# EAGLE schematic buck (EAGLE 9.3.0)

## Sheet 1 of 3: PLUGS
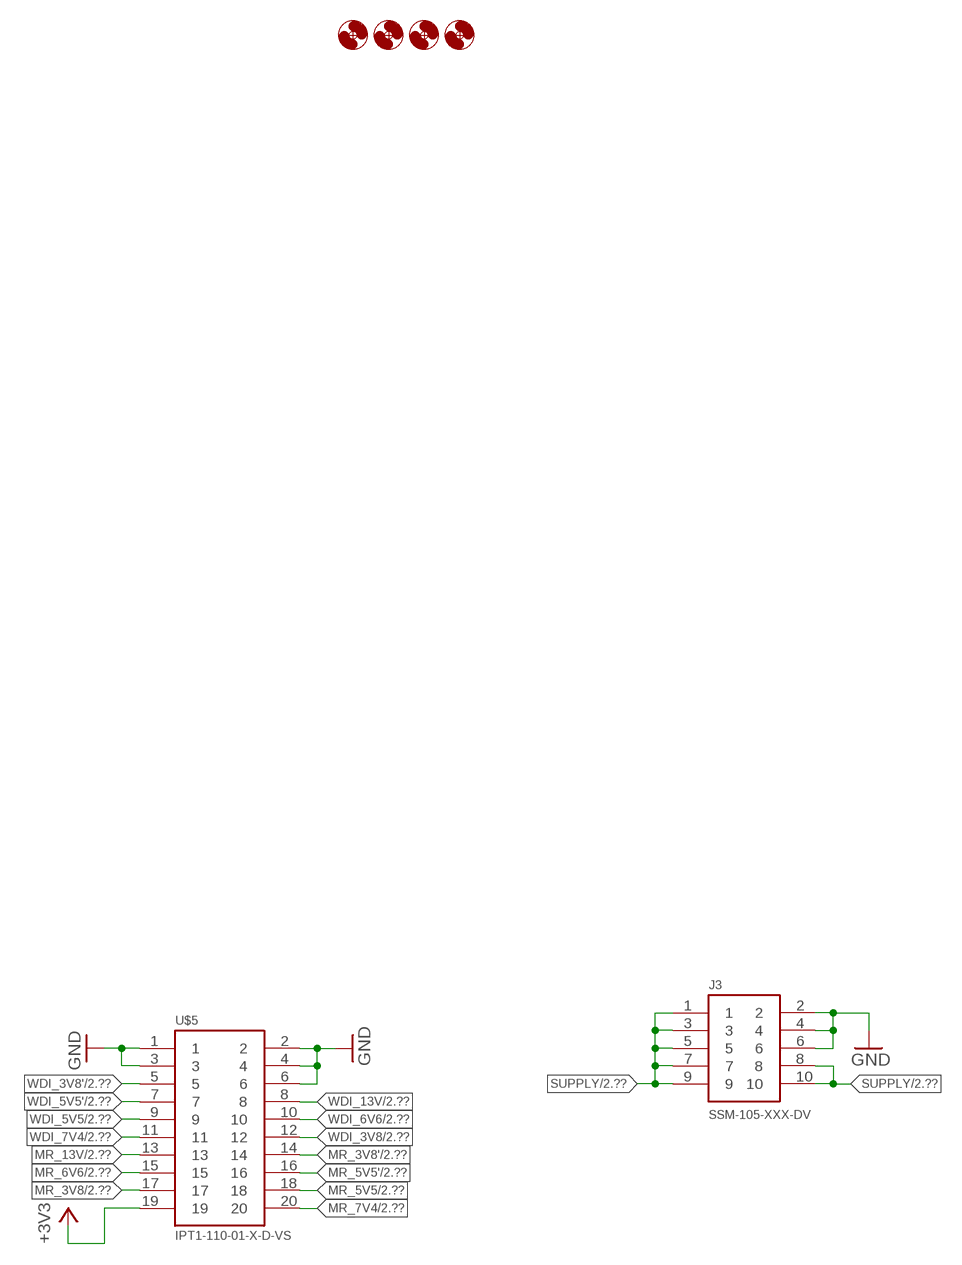
[diagram p0: schematic, sheet 1]

### Parts
H1  MOUNT-HOLE3.2  [3,2]
H2  MOUNT-HOLE3.2  [3,2]
H3  MOUNT-HOLE3.2  [3,2]
H4  MOUNT-HOLE3.2  [3,2]
J3  SSM-105-XXX-DV  [SSM-105-XXX-DV]
U$5  IPT1-110-01-X-D-VS  [IPT1-110-01-X-D-VS]

### Nets
+3V3: U$5.19 ; also sheet 2
GND: J3.2 J3.4 J3.6 U$5.1 U$5.2 U$5.3 U$5.4 U$5.6 ; also sheet 2,3
MR_3V8: U$5.17 ; also sheet 2
MR_3V8': U$5.14 ; also sheet 2
MR_5V5: U$5.18 ; also sheet 2
MR_5V5': U$5.16 ; also sheet 2
MR_6V6: U$5.15 ; also sheet 2
MR_7V4: U$5.20 ; also sheet 2
MR_13V: U$5.13 ; also sheet 2
SUPPLY [test]: J3.1 J3.3 J3.5 J3.7 J3.8 J3.9 J3.10 ; also sheet 2
WDI_3V8: U$5.12 ; also sheet 2
WDI_3V8': U$5.5 ; also sheet 2
WDI_5V5: U$5.9 ; also sheet 2
WDI_5V5': U$5.7 ; also sheet 2
WDI_6V6: U$5.10 ; also sheet 2
WDI_7V4: U$5.11 ; also sheet 2
WDI_13V: U$5.8 ; also sheet 2

## Sheet 2 of 3
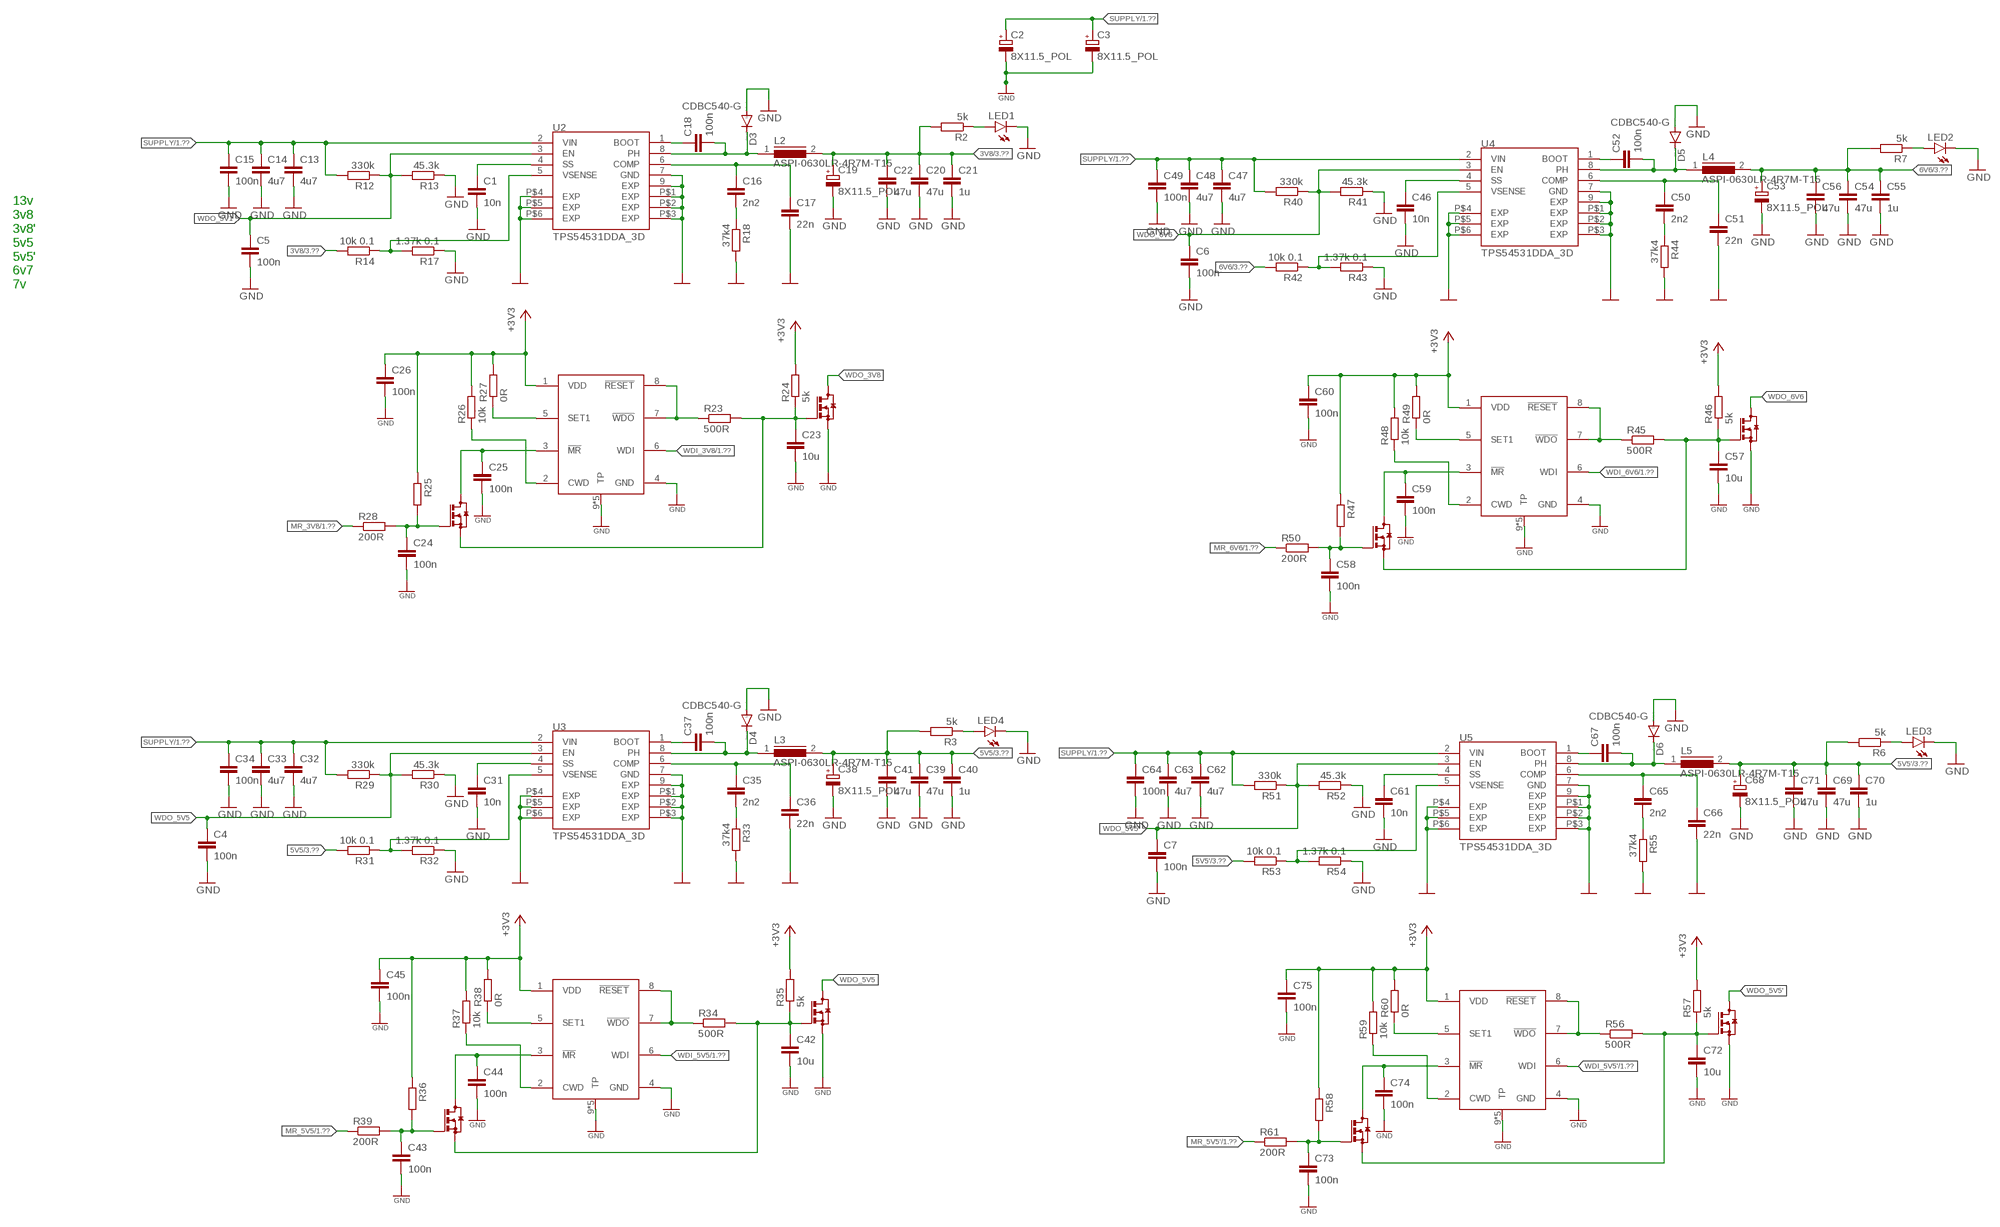
[diagram p1: schematic, sheet 2, part 1 of 2]
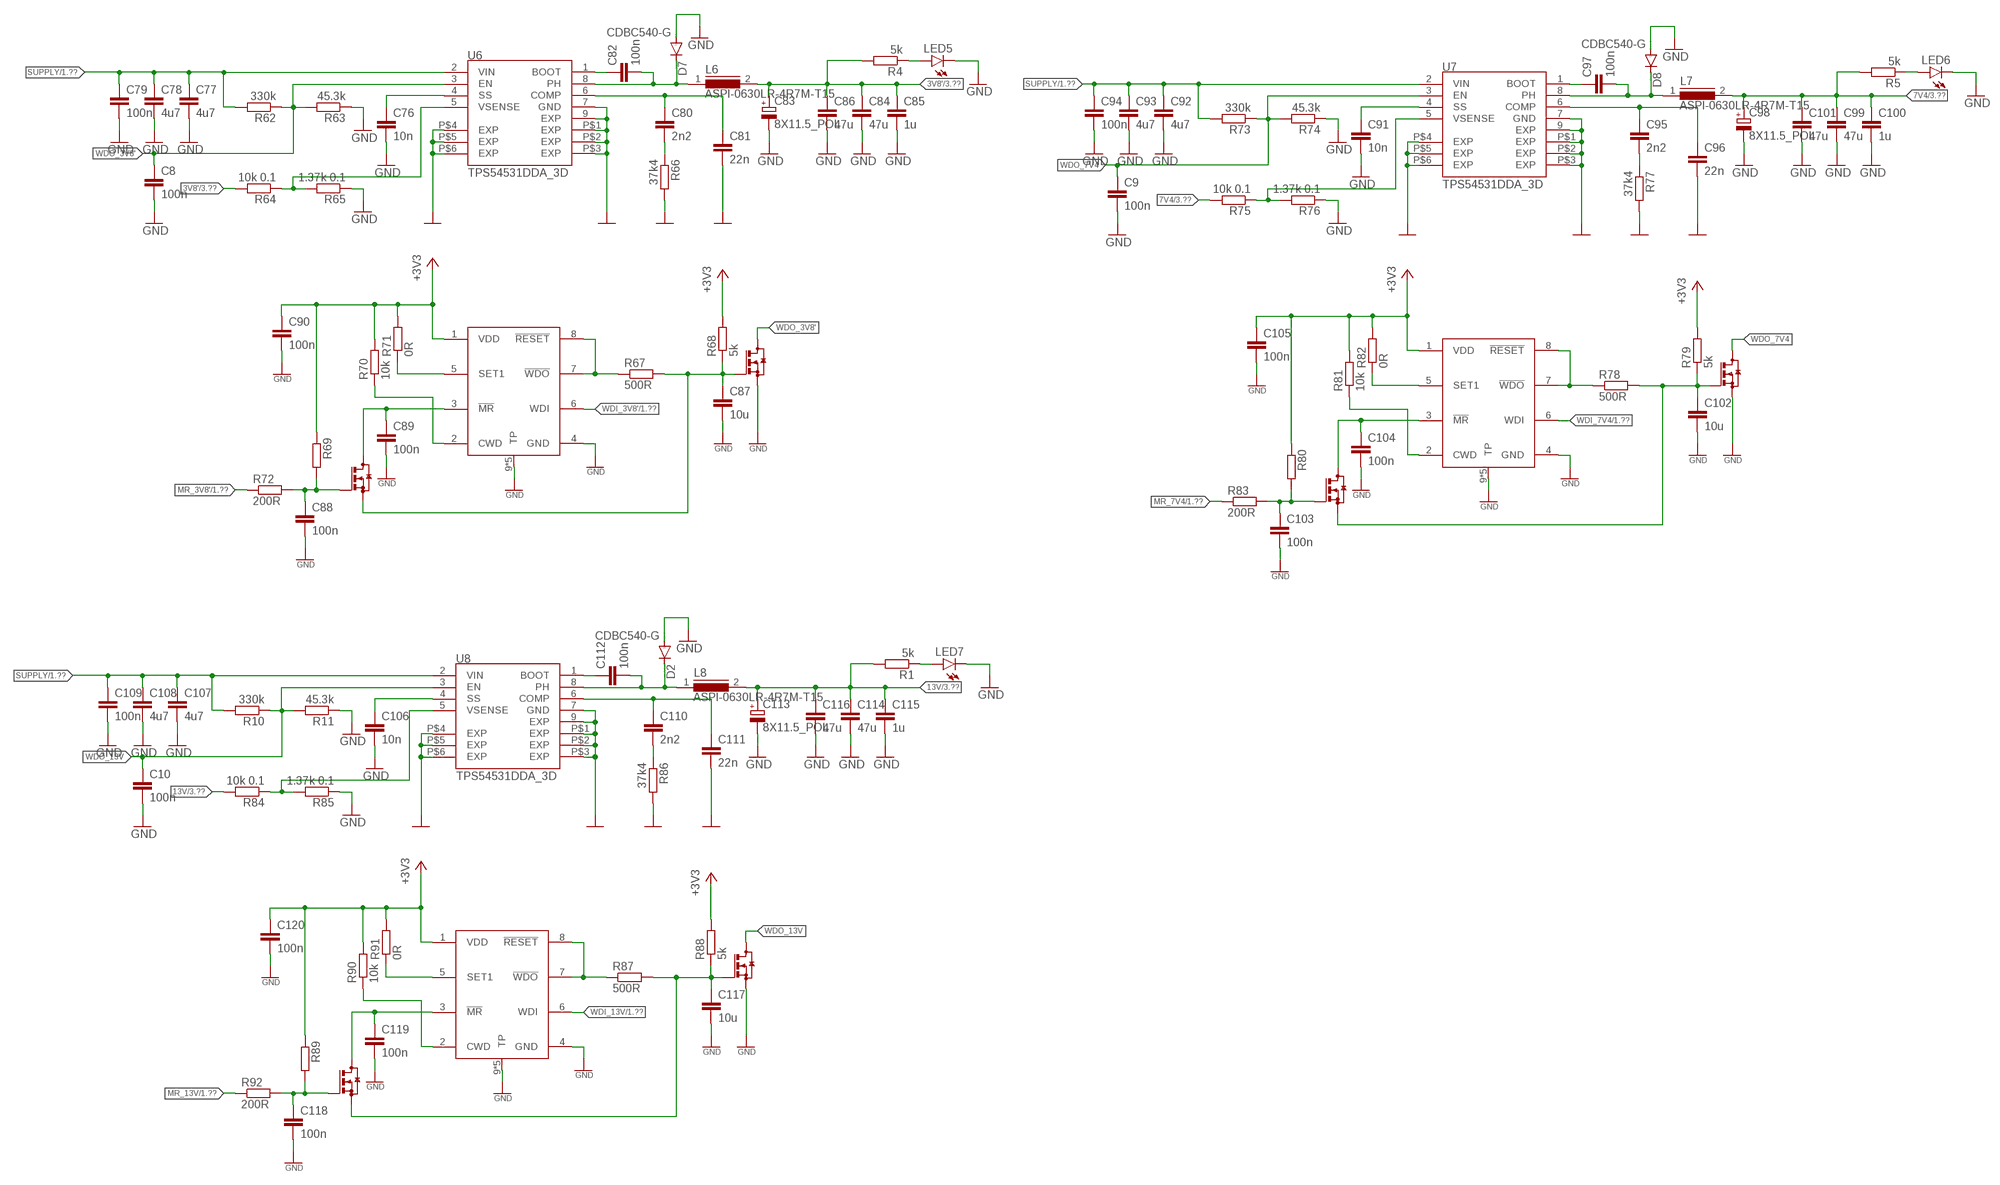
[diagram p2: schematic, sheet 2, part 2 of 2]

### Parts
C1  10n  C-EUC0603K  [C0603K]
C2  8X11.5_POL  [CAPPRD350W65D800H1150A]
C3  8X11.5_POL  [CAPPRD350W65D800H1150A]
C4  100n  C-EUC0603K  [C0603K]
C5  100n  C-EUC0603K  [C0603K]
C6  100n  C-EUC0603K  [C0603K]
C7  100n  C-EUC0603K  [C0603K]
C8  100n  C-EUC0603K  [C0603K]
C9  100n  C-EUC0603K  [C0603K]
C10  100n  C-EUC0603K  [C0603K]
C13  4u7  C-EUC0805K  [C0805K]
C14  4u7  C-EUC0805K  [C0805K]
C15  100n  C-EUC0603K  [C0603K]
C16  2n2  C-EUC0603K  [C0603K]
C17  22n  C-EUC0603K  [C0603K]
C18  100n  C-EUC0603K  [C0603K]
C19  8X11.5_POL  [CAPPRD350W65D800H1150A]
C20  47u  C-EUC1210  [C1210]
C21  1u  C-EUC0603K  [C0603K]
C22  47u  C-EUC1210  [C1210]
C23  10u  C-EUC0805K  [C0805K]
C24  100n  C-EUC0603K  [C0603K]
C25  100n  C-EUC0603K  [C0603K]
C26  100n  C-EUC0603K  [C0603K]
C31  10n  C-EUC0603K  [C0603K]
C32  4u7  C-EUC0805K  [C0805K]
C33  4u7  C-EUC0805K  [C0805K]
C34  100n  C-EUC0603K  [C0603K]
C35  2n2  C-EUC0603K  [C0603K]
C36  22n  C-EUC0603K  [C0603K]
C37  100n  C-EUC0603K  [C0603K]
C38  8X11.5_POL  [CAPPRD350W65D800H1150A]
C39  47u  C-EUC1210  [C1210]
C40  1u  C-EUC0603K  [C0603K]
C41  47u  C-EUC1210  [C1210]
C42  10u  C-EUC0805K  [C0805K]
C43  100n  C-EUC0603K  [C0603K]
C44  100n  C-EUC0603K  [C0603K]
C45  100n  C-EUC0603K  [C0603K]
C46  10n  C-EUC0603K  [C0603K]
C47  4u7  C-EUC0805K  [C0805K]
C48  4u7  C-EUC0805K  [C0805K]
C49  100n  C-EUC0603K  [C0603K]
C50  2n2  C-EUC0603K  [C0603K]
C51  22n  C-EUC0603K  [C0603K]
C52  100n  C-EUC0603K  [C0603K]
C53  8X11.5_POL  [CAPPRD350W65D800H1150A]
C54  47u  C-EUC1210  [C1210]
C55  1u  C-EUC0603K  [C0603K]
C56  47u  C-EUC1210  [C1210]
C57  10u  C-EUC0805K  [C0805K]
C58  100n  C-EUC0603K  [C0603K]
C59  100n  C-EUC0603K  [C0603K]
C60  100n  C-EUC0603K  [C0603K]
C61  10n  C-EUC0603K  [C0603K]
C62  4u7  C-EUC0805K  [C0805K]
C63  4u7  C-EUC0805K  [C0805K]
C64  100n  C-EUC0603K  [C0603K]
C65  2n2  C-EUC0603K  [C0603K]
C66  22n  C-EUC0603K  [C0603K]
C67  100n  C-EUC0603K  [C0603K]
C68  8X11.5_POL  [CAPPRD350W65D800H1150A]
C69  47u  C-EUC1210  [C1210]
C70  1u  C-EUC0603K  [C0603K]
C71  47u  C-EUC1210  [C1210]
C72  10u  C-EUC0805K  [C0805K]
C73  100n  C-EUC0603K  [C0603K]
C74  100n  C-EUC0603K  [C0603K]
C75  100n  C-EUC0603K  [C0603K]
C76  10n  C-EUC0603K  [C0603K]
C77  4u7  C-EUC0805K  [C0805K]
C78  4u7  C-EUC0805K  [C0805K]
C79  100n  C-EUC0603K  [C0603K]
C80  2n2  C-EUC0603K  [C0603K]
C81  22n  C-EUC0603K  [C0603K]
C82  100n  C-EUC0603K  [C0603K]
C83  8X11.5_POL  [CAPPRD350W65D800H1150A]
C84  47u  C-EUC1210  [C1210]
C85  1u  C-EUC0603K  [C0603K]
C86  47u  C-EUC1210  [C1210]
C87  10u  C-EUC0805K  [C0805K]
C88  100n  C-EUC0603K  [C0603K]
C89  100n  C-EUC0603K  [C0603K]
C90  100n  C-EUC0603K  [C0603K]
C91  10n  C-EUC0603K  [C0603K]
C92  4u7  C-EUC0805K  [C0805K]
C93  4u7  C-EUC0805K  [C0805K]
C94  100n  C-EUC0603K  [C0603K]
C95  2n2  C-EUC0603K  [C0603K]
C96  22n  C-EUC0603K  [C0603K]
C97  100n  C-EUC0603K  [C0603K]
C98  8X11.5_POL  [CAPPRD350W65D800H1150A]
C99  47u  C-EUC1210  [C1210]
C100  1u  C-EUC0603K  [C0603K]
C101  47u  C-EUC1210  [C1210]
C102  10u  C-EUC0805K  [C0805K]
C103  100n  C-EUC0603K  [C0603K]
C104  100n  C-EUC0603K  [C0603K]
C105  100n  C-EUC0603K  [C0603K]
C106  10n  C-EUC0603K  [C0603K]
C107  4u7  C-EUC0805K  [C0805K]
C108  4u7  C-EUC0805K  [C0805K]
C109  100n  C-EUC0603K  [C0603K]
C110  2n2  C-EUC0603K  [C0603K]
C111  22n  C-EUC0603K  [C0603K]
C112  100n  C-EUC0603K  [C0603K]
C113  8X11.5_POL  [CAPPRD350W65D800H1150A]
C114  47u  C-EUC1210  [C1210]
C115  1u  C-EUC0603K  [C0603K]
C116  47u  C-EUC1210  [C1210]
C117  10u  C-EUC0805K  [C0805K]
C118  100n  C-EUC0603K  [C0603K]
C119  100n  C-EUC0603K  [C0603K]
C120  100n  C-EUC0603K  [C0603K]
D2  CDBC540-G  DIODE-SMC  [SMC]
D3  CDBC540-G  DIODE-SMC  [SMC]
D4  CDBC540-G  DIODE-SMC  [SMC]
D5  CDBC540-G  DIODE-SMC  [SMC]
D6  CDBC540-G  DIODE-SMC  [SMC]
D7  CDBC540-G  DIODE-SMC  [SMC]
D8  CDBC540-G  DIODE-SMC  [SMC]
L2  ASPI-0630LR-4R7M-T15  DR74  [DR74]
L3  ASPI-0630LR-4R7M-T15  DR74  [DR74]
L4  ASPI-0630LR-4R7M-T15  DR74  [DR74]
L5  ASPI-0630LR-4R7M-T15  DR74  [DR74]
L6  ASPI-0630LR-4R7M-T15  DR74  [DR74]
L7  ASPI-0630LR-4R7M-T15  DR74  [DR74]
L8  ASPI-0630LR-4R7M-T15  DR74  [DR74]
LED1  LEDCHIPLED_0603  [CHIPLED_0603]
LED2  LEDCHIPLED_0603  [CHIPLED_0603]
LED3  LEDCHIPLED_0603  [CHIPLED_0603]
LED4  LEDCHIPLED_0603  [CHIPLED_0603]
LED5  LEDCHIPLED_0603  [CHIPLED_0603]
LED6  LEDCHIPLED_0603  [CHIPLED_0603]
LED7  LEDCHIPLED_0603  [CHIPLED_0603]
Q1  BSS123  [SOT23]
Q2  BSS123  [SOT23]
Q5  BSS123  [SOT23]
Q6  BSS123  [SOT23]
Q7  BSS123  [SOT23]
Q8  BSS123  [SOT23]
Q9  BSS123  [SOT23]
Q10  BSS123  [SOT23]
Q11  BSS123  [SOT23]
Q12  BSS123  [SOT23]
Q13  BSS123  [SOT23]
Q14  BSS123  [SOT23]
Q15  BSS123  [SOT23]
Q16  BSS123  [SOT23]
R1  5k  R-EU_R0603  [R0603]
R2  5k  R-EU_R0603  [R0603]
R3  5k  R-EU_R0603  [R0603]
R4  5k  R-EU_R0603  [R0603]
R5  5k  R-EU_R0603  [R0603]
R6  5k  R-EU_R0603  [R0603]
R7  5k  R-EU_R0603  [R0603]
R10  330k  R-EU_R0603  [R0603]
R11  45.3k  R-EU_R0603  [R0603]
R12  330k  R-EU_R0603  [R0603]
R13  45.3k  R-EU_R0603  [R0603]
R14  10k 0.1  R-EU_R0603  [R0603]
R17  1.37k 0.1  R-EU_R0603  [R0603]
R18  37k4  R-EU_R0603  [R0603]
R23  500R  R-EU_R0603  [R0603]
R24  5k  R-EU_R0603  [R0603]
R25  R-EU_R0603  [R0603]
R26  10k  R-EU_R0603  [R0603]
R27  0R  R-EU_R0603  [R0603]
R28  200R  R-EU_R0603  [R0603]
R29  330k  R-EU_R0603  [R0603]
R30  45.3k  R-EU_R0603  [R0603]
R31  10k 0.1  R-EU_R0603  [R0603]
R32  1.37k 0.1  R-EU_R0603  [R0603]
R33  37k4  R-EU_R0603  [R0603]
R34  500R  R-EU_R0603  [R0603]
R35  5k  R-EU_R0603  [R0603]
R36  R-EU_R0603  [R0603]
R37  10k  R-EU_R0603  [R0603]
R38  0R  R-EU_R0603  [R0603]
R39  200R  R-EU_R0603  [R0603]
R40  330k  R-EU_R0603  [R0603]
R41  45.3k  R-EU_R0603  [R0603]
R42  10k 0.1  R-EU_R0603  [R0603]
R43  1.37k 0.1  R-EU_R0603  [R0603]
R44  37k4  R-EU_R0603  [R0603]
R45  500R  R-EU_R0603  [R0603]
R46  5k  R-EU_R0603  [R0603]
R47  R-EU_R0603  [R0603]
R48  10k  R-EU_R0603  [R0603]
R49  0R  R-EU_R0603  [R0603]
R50  200R  R-EU_R0603  [R0603]
R51  330k  R-EU_R0603  [R0603]
R52  45.3k  R-EU_R0603  [R0603]
R53  10k 0.1  R-EU_R0603  [R0603]
R54  1.37k 0.1  R-EU_R0603  [R0603]
R55  37k4  R-EU_R0603  [R0603]
R56  500R  R-EU_R0603  [R0603]
R57  5k  R-EU_R0603  [R0603]
R58  R-EU_R0603  [R0603]
R59  10k  R-EU_R0603  [R0603]
R60  0R  R-EU_R0603  [R0603]
R61  200R  R-EU_R0603  [R0603]
R62  330k  R-EU_R0603  [R0603]
R63  45.3k  R-EU_R0603  [R0603]
R64  10k 0.1  R-EU_R0603  [R0603]
R65  1.37k 0.1  R-EU_R0603  [R0603]
R66  37k4  R-EU_R0603  [R0603]
R67  500R  R-EU_R0603  [R0603]
R68  5k  R-EU_R0603  [R0603]
R69  R-EU_R0603  [R0603]
R70  10k  R-EU_R0603  [R0603]
R71  0R  R-EU_R0603  [R0603]
R72  200R  R-EU_R0603  [R0603]
R73  330k  R-EU_R0603  [R0603]
R74  45.3k  R-EU_R0603  [R0603]
R75  10k 0.1  R-EU_R0603  [R0603]
R76  1.37k 0.1  R-EU_R0603  [R0603]
R77  37k4  R-EU_R0603  [R0603]
R78  500R  R-EU_R0603  [R0603]
R79  5k  R-EU_R0603  [R0603]
R80  R-EU_R0603  [R0603]
R81  10k  R-EU_R0603  [R0603]
R82  0R  R-EU_R0603  [R0603]
R83  200R  R-EU_R0603  [R0603]
R84  10k 0.1  R-EU_R0603  [R0603]
R85  1.37k 0.1  R-EU_R0603  [R0603]
R86  37k4  R-EU_R0603  [R0603]
R87  500R  R-EU_R0603  [R0603]
R88  5k  R-EU_R0603  [R0603]
R89  R-EU_R0603  [R0603]
R90  10k  R-EU_R0603  [R0603]
R91  0R  R-EU_R0603  [R0603]
R92  200R  R-EU_R0603  [R0603]
U2  TPS54531DDA_3D  [SOIC127P600X150-9T240X310]
U3  TPS54531DDA_3D  [SOIC127P600X150-9T240X310]
U4  TPS54531DDA_3D  [SOIC127P600X150-9T240X310]
U5  TPS54531DDA_3D  [SOIC127P600X150-9T240X310]
U6  TPS54531DDA_3D  [SOIC127P600X150-9T240X310]
U7  TPS54531DDA_3D  [SOIC127P600X150-9T240X310]
U8  TPS54531DDA_3D  [SOIC127P600X150-9T240X310]
U$6  TPS3852  [SON65P300X300X100-9N]
U$7  TPS3852  [SON65P300X300X100-9N]
U$8  TPS3852  [SON65P300X300X100-9N]
U$9  TPS3852  [SON65P300X300X100-9N]
U$10  TPS3852  [SON65P300X300X100-9N]
U$11  TPS3852  [SON65P300X300X100-9N]
U$12  TPS3852  [SON65P300X300X100-9N]

### Nets
3V8 [test]: C19.1(+) C20.1 C21.1 C22.1 L2.2 R2.2 R14.2 ; also sheet 3
3V8' [test]: C83.1(+) C84.1 C85.1 C86.1 L6.2 R4.2 R64.2 ; also sheet 3
5V5 [test]: C38.1(+) C39.1 C40.1 C41.1 L3.2 R3.2 R31.2 ; also sheet 3
5V5' [test]: C68.1(+) C69.1 C70.1 C71.1 L5.2 R6.2 R53.2 ; also sheet 3
6V6 [test]: C53.1(+) C54.1 C55.1 C56.1 L4.2 R7.2 R42.2 ; also sheet 3
7V4 [test]: C98.1(+) C99.1 C100.1 C101.1 L7.2 R5.2 R75.2 ; also sheet 3
13V [test]: C113.1(+) C114.1 C115.1 C116.1 L8.2 R1.2 R84.2 ; also sheet 3
+3V3: C26.1 C45.1 C60.1 C75.1 C90.1 C105.1 C120.1 R24.2 R25.1 R26.2 R27.2 R35.2 R36.1 R37.2 R38.2 R46.2 R47.1 R48.2 R49.2 R57.2 R58.1 R59.2 R60.2 R68.2 R69.1 R70.2 R71.2 R79.2 R80.1 R81.2 R82.2 R88.2 R89.1 R90.2 R91.2 U$6.1(VDD) U$7.1(VDD) U$8.1(VDD) U$9.1(VDD) U$10.1(VDD) U$11.1(VDD) U$12.1(VDD) ; also sheet 1
ENABLE2: C24.1 Q2.1(G) R25.2 R28.2
ENABLE3: C43.1 Q6.1(G) R36.2 R39.2
ENABLE4: C58.1 Q8.1(G) R47.2 R50.2
ENABLE5: C73.1 Q10.1(G) R58.2 R61.2
ENABLE6: C88.1 Q12.1(G) R69.2 R72.2
ENABLE7: C103.1 Q14.1(G) R80.2 R83.2
ENABLE8: C118.1 Q16.1(G) R89.2 R92.2
GND: C1.2 C2.2(-) C3.2(-) C4.2 C5.2 C6.2 C7.2 C8.2 C9.2 C10.2 C13.2 C14.2 C15.2 C17.2 C19.2(-) C20.2 C21.2 C22.2 C23.2 C24.2 C25.2 C26.2 C31.2 C32.2 C33.2 C34.2 C36.2 C38.2(-) C39.2 C40.2 C41.2 C42.2 C43.2 C44.2 C45.2 C46.2 C47.2 C48.2 C49.2 C51.2 C53.2(-) C54.2 C55.2 C56.2 C57.2 C58.2 C59.2 C60.2 C61.2 C62.2 C63.2 C64.2 C66.2 C68.2(-) C69.2 C70.2 C71.2 C72.2 C73.2 C74.2 C75.2 C76.2 C77.2 C78.2 C79.2 C81.2 C83.2(-) C84.2 C85.2 C86.2 C87.2 C88.2 C89.2 C90.2 C91.2 C92.2 C93.2 C94.2 C96.2 C98.2(-) C99.2 C100.2 C101.2 C102.2 C103.2 C104.2 C105.2 C106.2 C107.2 C108.2 C109.2 C111.2 C113.2(-) C114.2 C115.2 C116.2 C117.2 C118.2 C119.2 C120.2 D2.A D3.A D4.A D5.A D6.A D7.A D8.A LED1.C LED2.C LED3.C LED4.C LED5.C LED6.C LED7.C Q1.2(S) Q5.2(S) Q7.2(S) Q9.2(S) Q11.2(S) Q13.2(S) Q15.2(S) R11.1 R13.1 R17.1 R18.2 R30.1 R32.1 R33.2 R41.1 R43.1 R44.2 R52.1 R54.1 R55.2 R63.1 R65.1 R66.2 R74.1 R76.1 R77.2 R85.1 R86.2 U2.7(GND) U2.9(EXP) U2.P$1(EXP) U2.P$2(EXP) U2.P$3(EXP) U2.P$4(EXP) U2.P$5(EXP) U2.P$6(EXP) U3.7(GND) U3.9(EXP) U3.P$1(EXP) U3.P$2(EXP) U3.P$3(EXP) U3.P$4(EXP) U3.P$5(EXP) U3.P$6(EXP) U4.7(GND) U4.9(EXP) U4.P$1(EXP) U4.P$2(EXP) U4.P$3(EXP) U4.P$4(EXP) U4.P$5(EXP) U4.P$6(EXP) U5.7(GND) U5.9(EXP) U5.P$1(EXP) U5.P$2(EXP) U5.P$3(EXP) U5.P$4(EXP) U5.P$5(EXP) U5.P$6(EXP) U6.7(GND) U6.9(EXP) U6.P$1(EXP) U6.P$2(EXP) U6.P$3(EXP) U6.P$4(EXP) U6.P$5(EXP) U6.P$6(EXP) U7.7(GND) U7.9(EXP) U7.P$1(EXP) U7.P$2(EXP) U7.P$3(EXP) U7.P$4(EXP) U7.P$5(EXP) U7.P$6(EXP) U8.7(GND) U8.9(EXP) U8.P$1(EXP) U8.P$2(EXP) U8.P$3(EXP) U8.P$4(EXP) U8.P$5(EXP) U8.P$6(EXP) U$6.4(GND) U$6.9(TP) U$6.9_1(TP) U$6.9_2(TP) U$6.9_3(TP) U$6.9_4(TP) U$7.4(GND) U$7.9(TP) U$7.9_1(TP) U$7.9_2(TP) U$7.9_3(TP) U$7.9_4(TP) U$8.4(GND) U$8.9(TP) U$8.9_1(TP) U$8.9_2(TP) U$8.9_3(TP) U$8.9_4(TP) U$9.4(GND) U$9.9(TP) U$9.9_1(TP) U$9.9_2(TP) U$9.9_3(TP) U$9.9_4(TP) U$10.4(GND) U$10.9(TP) U$10.9_1(TP) U$10.9_2(TP) U$10.9_3(TP) U$10.9_4(TP) U$11.4(GND) U$11.9(TP) U$11.9_1(TP) U$11.9_2(TP) U$11.9_3(TP) U$11.9_4(TP) U$12.4(GND) U$12.9(TP) U$12.9_1(TP) U$12.9_2(TP) U$12.9_3(TP) U$12.9_4(TP) ; also sheet 1,3
MAIN_SUPPLY_DIS2: C23.1 Q1.1(G) Q2.2(S) R23.2 R24.1
MAIN_SUPPLY_DIS3: C42.1 Q5.1(G) Q6.2(S) R34.2 R35.1
MAIN_SUPPLY_DIS4: C57.1 Q7.1(G) Q8.2(S) R45.2 R46.1
MAIN_SUPPLY_DIS5: C72.1 Q9.1(G) Q10.2(S) R56.2 R57.1
MAIN_SUPPLY_DIS6: C87.1 Q11.1(G) Q12.2(S) R67.2 R68.1
MAIN_SUPPLY_DIS7: C102.1 Q13.1(G) Q14.2(S) R78.2 R79.1
MAIN_SUPPLY_DIS8: C117.1 Q15.1(G) Q16.2(S) R87.2 R88.1
MR_3V8: R28.1 ; also sheet 1
MR_3V8': R72.1 ; also sheet 1
MR_5V5: R39.1 ; also sheet 1
MR_5V5': R61.1 ; also sheet 1
MR_6V6: R50.1 ; also sheet 1
MR_7V4: R83.1 ; also sheet 1
MR_13V: R92.1 ; also sheet 1
N$1: LED7.A R1.1
N$2: LED1.A R2.1
N$3: LED4.A R3.1
N$4: LED5.A R4.1
N$5: LED6.A R5.1
N$6: LED3.A R6.1
N$7: LED2.A R7.1
N$14: R84.1 R85.2 U8.5(VSENSE)
N$18: R14.1 R17.2 U2.5(VSENSE)
N$19: C1.1 U2.4(SS)
N$20: C16.1 C17.1 U2.6(COMP)
N$21: C16.2 R18.1
N$22: C18.1 U2.1(BOOT)
N$23 [test]: C18.2 D3.C L2.1 U2.8(PH)
N$24: R23.1 U$6.7(!WDO) U$6.8(!RESET)
N$25: C25.1 Q2.3(D) U$6.3(!MR)
N$26: R26.1 U$6.2(CWD)
N$27: R27.1 U$6.5(SET1)
N$28: C106.1 U8.4(SS)
N$29: R31.1 R32.2 U3.5(VSENSE)
N$30: C31.1 U3.4(SS)
N$31: C35.1 C36.1 U3.6(COMP)
N$32: C35.2 R33.1
N$33: C37.1 U3.1(BOOT)
N$34 [test]: C37.2 D4.C L3.1 U3.8(PH)
N$35: R34.1 U$7.7(!WDO) U$7.8(!RESET)
N$36: C44.1 Q6.3(D) U$7.3(!MR)
N$37: R37.1 U$7.2(CWD)
N$38: R38.1 U$7.5(SET1)
N$39: R42.1 R43.2 U4.5(VSENSE)
N$40: C46.1 U4.4(SS)
N$41: C50.1 C51.1 U4.6(COMP)
N$42: C50.2 R44.1
N$43: C52.1 U4.1(BOOT)
N$44 [test]: C52.2 D5.C L4.1 U4.8(PH)
N$45: R45.1 U$8.7(!WDO) U$8.8(!RESET)
N$46: C59.1 Q8.3(D) U$8.3(!MR)
N$47: R48.1 U$8.2(CWD)
N$48: R49.1 U$8.5(SET1)
N$49: R53.1 R54.2 U5.5(VSENSE)
N$50: C61.1 U5.4(SS)
N$51: C65.1 C66.1 U5.6(COMP)
N$52: C65.2 R55.1
N$53: C67.1 U5.1(BOOT)
N$54 [test]: C67.2 D6.C L5.1 U5.8(PH)
N$55: R56.1 U$9.7(!WDO) U$9.8(!RESET)
N$56: C74.1 Q10.3(D) U$9.3(!MR)
N$57: R59.1 U$9.2(CWD)
N$58: R60.1 U$9.5(SET1)
N$59: R64.1 R65.2 U6.5(VSENSE)
N$60: C76.1 U6.4(SS)
N$61: C80.1 C81.1 U6.6(COMP)
N$62: C80.2 R66.1
N$63: C82.1 U6.1(BOOT)
N$64 [test]: C82.2 D7.C L6.1 U6.8(PH)
N$65: R67.1 U$10.7(!WDO) U$10.8(!RESET)
N$66: C89.1 Q12.3(D) U$10.3(!MR)
N$67: R70.1 U$10.2(CWD)
N$68: R71.1 U$10.5(SET1)
N$69: R75.1 R76.2 U7.5(VSENSE)
N$70: C91.1 U7.4(SS)
N$71: C95.1 C96.1 U7.6(COMP)
N$72: C95.2 R77.1
N$73: C97.1 U7.1(BOOT)
N$74 [test]: C97.2 D8.C L7.1 U7.8(PH)
N$75: R78.1 U$11.7(!WDO) U$11.8(!RESET)
N$76: C104.1 Q14.3(D) U$11.3(!MR)
N$77: R81.1 U$11.2(CWD)
N$78: R82.1 U$11.5(SET1)
N$79: C110.1 C111.1 U8.6(COMP)
N$80: C110.2 R86.1
N$81: C112.1 U8.1(BOOT)
N$82 [test]: C112.2 D2.C L8.1 U8.8(PH)
N$83: R87.1 U$12.7(!WDO) U$12.8(!RESET)
N$84: C119.1 Q16.3(D) U$12.3(!MR)
N$85: R90.1 U$12.2(CWD)
N$86: R91.1 U$12.5(SET1)
SUPPLY [test]: C2.1(+) C3.1(+) C13.1 C14.1 C15.1 C32.1 C33.1 C34.1 C47.1 C48.1 C49.1 C62.1 C63.1 C64.1 C77.1 C78.1 C79.1 C92.1 C93.1 C94.1 C107.1 C108.1 C109.1 R10.2 R12.2 R29.2 R40.2 R51.2 R62.2 R73.2 U2.2(VIN) U3.2(VIN) U4.2(VIN) U5.2(VIN) U6.2(VIN) U7.2(VIN) U8.2(VIN) ; also sheet 1
WDI_3V8: U$6.6(WDI) ; also sheet 1
WDI_3V8': U$10.6(WDI) ; also sheet 1
WDI_5V5: U$7.6(WDI) ; also sheet 1
WDI_5V5': U$9.6(WDI) ; also sheet 1
WDI_6V6: U$8.6(WDI) ; also sheet 1
WDI_7V4: U$11.6(WDI) ; also sheet 1
WDI_13V: U$12.6(WDI) ; also sheet 1
WDO_3V8: Q1.3(D)
WDO_3V8': C8.1 Q11.3(D) R62.1 R63.2 U6.3(EN)
WDO_5V1: C5.1 R12.1 R13.2 U2.3(EN)
WDO_5V5: C4.1 Q5.3(D) R29.1 R30.2 U3.3(EN)
WDO_5V5': C7.1 Q9.3(D) R51.1 R52.2 U5.3(EN)
WDO_6V6: C6.1 Q7.3(D) R40.1 R41.2 U4.3(EN)
WDO_7V4: C9.1 Q13.3(D) R73.1 R74.2 U7.3(EN)
WDO_13V: C10.1 Q15.3(D) R10.1 R11.2 U8.3(EN)

### Notes on the sheet
- 13v
  3v8
  3v8'
  5v5
  5v5'
  6v7
  7v

## Sheet 3 of 3: PLUGS
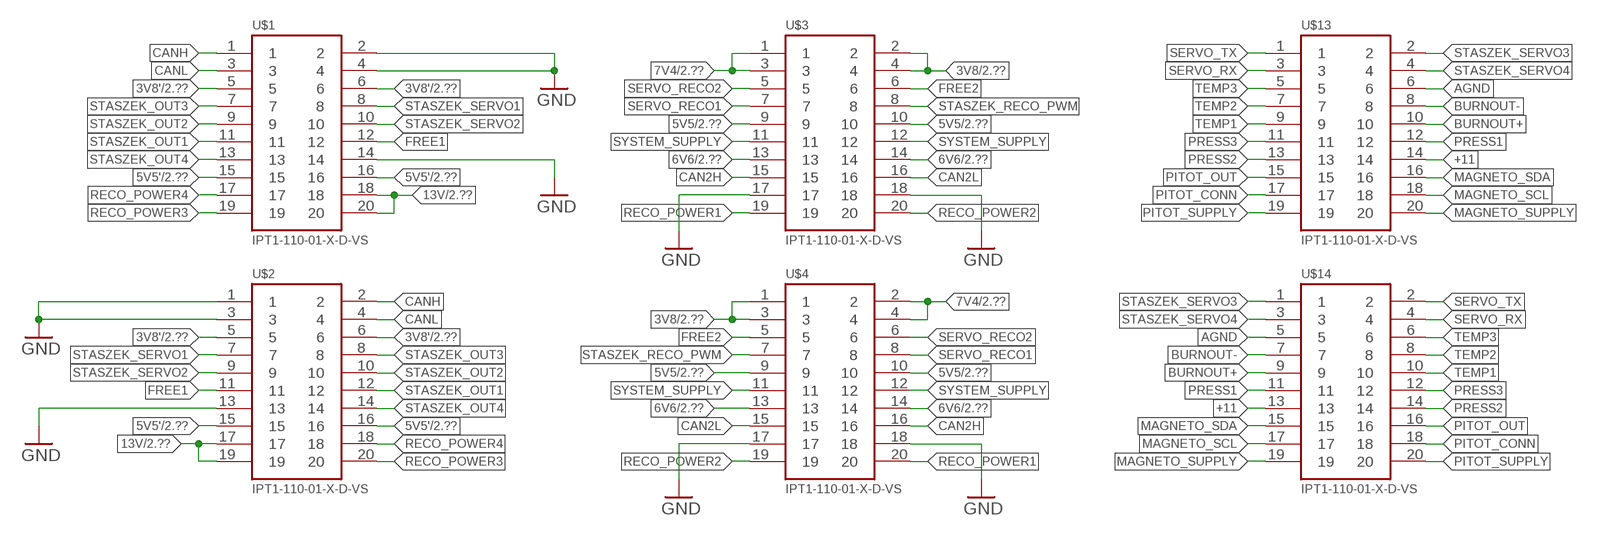
[diagram p3: schematic, sheet 3]

### Parts
U$1  IPT1-110-01-X-D-VS  [IPT1-110-01-X-D-VS]
U$2  IPT1-110-01-X-D-VS  [IPT1-110-01-X-D-VS]
U$3  IPT1-110-01-X-D-VS  [IPT1-110-01-X-D-VS]
U$4  IPT1-110-01-X-D-VS  [IPT1-110-01-X-D-VS]
U$13  IPT1-110-01-X-D-VS  [IPT1-110-01-X-D-VS]
U$14  IPT1-110-01-X-D-VS  [IPT1-110-01-X-D-VS]

### Nets
3V8 [test]: U$3.2 U$3.4 U$4.1 U$4.3 ; also sheet 2
3V8' [test]: U$1.5 U$1.6 U$2.5 U$2.6 ; also sheet 2
5V5 [test]: U$3.9 U$3.10 U$4.9 U$4.10 ; also sheet 2
5V5' [test]: U$1.15 U$1.16 U$2.15 U$2.16 ; also sheet 2
6V6 [test]: U$3.13 U$3.14 U$4.13 U$4.14 ; also sheet 2
7V4 [test]: U$3.1 U$3.3 U$4.2 U$4.4 ; also sheet 2
13V [test]: U$1.18 U$1.20 U$2.17 U$2.19 ; also sheet 2
+11: U$13.14 U$14.13
AGND: U$13.6 U$14.5
BURNOUT+: U$13.10 U$14.9
BURNOUT-: U$13.8 U$14.7
CAN2H: U$3.15 U$4.16
CAN2L: U$3.16 U$4.15
CANH: U$1.1 U$2.2
CANL: U$1.3 U$2.4
FREE1: U$1.12 U$2.11
FREE2: U$3.6 U$4.5
GND: U$1.2 U$1.4 U$1.14 U$2.1 U$2.3 U$2.13 U$3.17 U$3.18 U$4.17 U$4.18 ; also sheet 1,2
MAGNETO_SCL: U$13.18 U$14.17
MAGNETO_SDA: U$13.16 U$14.15
MAGNETO_SUPPLY: U$13.20 U$14.19
PITOT_CONN: U$13.17 U$14.18
PITOT_OUT: U$13.15 U$14.16
PITOT_SUPPLY: U$13.19 U$14.20
PRESS1: U$13.12 U$14.11
PRESS2: U$13.13 U$14.14
PRESS3: U$13.11 U$14.12
RECO_POWER1: U$3.19 U$4.20
RECO_POWER2: U$3.20 U$4.19
RECO_POWER3: U$1.19 U$2.20
RECO_POWER4: U$1.17 U$2.18
SERVO_RECO1: U$3.7 U$4.8
SERVO_RECO2: U$3.5 U$4.6
SERVO_RX: U$13.3 U$14.4
SERVO_TX: U$13.1 U$14.2
STASZEK_OUT1: U$1.11 U$2.12
STASZEK_OUT2: U$1.9 U$2.10
STASZEK_OUT3: U$1.7 U$2.8
STASZEK_OUT4: U$1.13 U$2.14
STASZEK_RECO_PWM: U$3.8 U$4.7
STASZEK_SERVO1: U$1.8 U$2.7
STASZEK_SERVO2: U$1.10 U$2.9
STASZEK_SERVO3: U$13.2 U$14.1
STASZEK_SERVO4: U$13.4 U$14.3
SYSTEM_SUPPLY: U$3.11 U$3.12 U$4.11 U$4.12
TEMP1: U$13.9 U$14.10
TEMP2: U$13.7 U$14.8
TEMP3: U$13.5 U$14.6

## Library data of the parts
C1 C4-C10 C13-C18 C20-C26 C31-C37 C39-C52 C54-C67 C69-C82 C84-C97 C99-C112 C114-C120 = rcl:C-EU: CAPACITOR, European symbol; SPICEPREFIX: C
C2 C3 C19 C38 C53 C68 C83 C98 C113 = Capacitors_SS:8X11.5_POL
D2-D8 = diode:DIODE-: DIODE
H1-H4 = holes:MOUNT-HOLE: MOUNTING HOLE with drill center marker
J3 = SMD_254_10:SSM-105-XXX-DV: .100" TIGER BEAM SOCKET ASAEMBLY.; AVAILABILITY: Unavailable; DESCRIPTION: .100 _2.54 mm_ Tiger Claw™ Surface Mount Socket Strip 10 positions; MF: Samtec; MP: SSM-105-XXX-DV; PACKAGE: None; PRICE: None
L2-L8 = inductors:DR74: High Power Density, High Efficiency, Shielded Inductors Source: coiltronics_dr_series.pdf; SPICEPREFIX: L
LED1-LED7 = led:LED: LED OSRAM: - CHIPLED LG R971, LG N971, LY N971, LG Q971, LY Q971, LO R971, LY R971 LH N974, LH R974 LS Q976, LO Q976, LY Q976 LO Q996 - Hyper CHIPLED LW Q18S LB Q993, LB Q99A, LB R99A - SideLED LS A670, LO A670, LY A670, LG A670, LP A670 LB A673, LV A673, LT A673, LW A673 LH A674 LY A675 LS A676, LA A676, LO A676, LY A676, LW A676 LS A679, LY A679, LG A679 - Hyper Micro SIDELED® LS Y876, LA Y876, LO Y876, LY Y876 LT Y87S - SmartLED LW L88C, LW L88S LB L89C, LB L89S, LG L890 LS L89K, LO L89K, LY L89K LS L896, LA L896, LO L896, LY L896 - TOPLED LS T670, LO T670, LY T670, LG T670, LP T670 LSG T670, LSP T670, LSY T670, LOP T670, LYG T670 LG T671, LOG T671, LSG T671 LB T673, LV T673, LT T673, LW T673 LH T674 LS T676, LA T676, LO T676, LY T676, LB T676, LH T676, LSB T676, LW T676 LB T67C, LV T67C, LT T67C, LS T67K, LO T67K, LY T67K, LW E67C LS E67B, LA E67B, LO E67B, LY E67B, LB E67C, LV E67C, LT E67C LW T67C LS T679, LY T679, LG T679 LS T770, LO T770, LY T770, LG T770, LP T770 LB T773, LV T773, LT T773, LW T773 LH T774 LS E675, LA E675, LY E675, LS T675 LS T776, LA T776, LO T776, LY T776, LB T776 LHGB T686 LT T68C, LB T68C - Hyper Mini TOPLED® LB M676 - Mini TOPLED Santana® LG M470 LS M47K, LO M47K, LY M47K Source: http://www.osram.convergy.de LUXEON: - LUMILED® LXK2-PW12-R00, LXK2-PW12-S00, LXK2-PW14-U00, LXK2-PW14-V00 LXK2-PM12-R00, LXK2-PM12-S00, LXK2-PM14-U00 LXK2-PE12-Q00, LXK2-PE12-R00, LXK2-PE12-S00, LXK2-PE14-T00, LXK2-PE14-U00 LXK2-PB12-K00, LXK2-PB12-L00, LXK2-PB12-M00, LXK2-PB14-N00, LXK2-PB14-P00, LXK2-PB14-Q00 LXK2-PR12-L00, LXK2-PR12-M00, LXK2-PR14-Q00, LXK2-PR14-R00 LXK2-PD12-Q00, LXK2-PD12-R00, LXK2-PD12-S00 LXK2-PH12-R00, LXK2-PH12-S00 LXK2-PL12-P00, LXK2-PL12-Q00, LXK2-PL12-R00 Source: www.luxeon.com KINGBRIGHT: KA-3528ASYC Source: www.kingbright.com
Q1 Q5 Q7 Q9 Q11 Q13 Q15 = transistor-small-signal:BSS123: N-CHANNEL MOS FET; SPICEPREFIX: Q
Q2 Q6 Q8 Q10 Q12 Q14 Q16 = transistor-small-signal:BSS123: N-CHANNEL MOS FET
R1-R7 R10-R14 R17 R18 R23-R92 = rcl:R-EU_: RESISTOR, European symbol; SPICEPREFIX: R
U2-U8 = TPS54531DDA:TPS54531DDA_3D
U$1-U$5 U$13 U$14 = smd_2.54_20pos:IPT1-110-01-X-D-VS: .100 DOUBLE ROW SHROUDED TERMINAL ASSEMBLY.; AVAILABILITY: Unavailable; DESCRIPTION: Conn Isolated Power Terminal Strip HDR 20 POS 2.54mm Solder ST SMD 20 Terminal 1 Port Tube; MF: Samtec; MP: IPT1-110--01-S-D-VS-; PACKAGE: None; PRICE: None
U$6-U$12 = tps3852:TPS3852

## Net classes
1 test: width 0.254 mm, drill 3.5 mm, clearance 0.356 mm